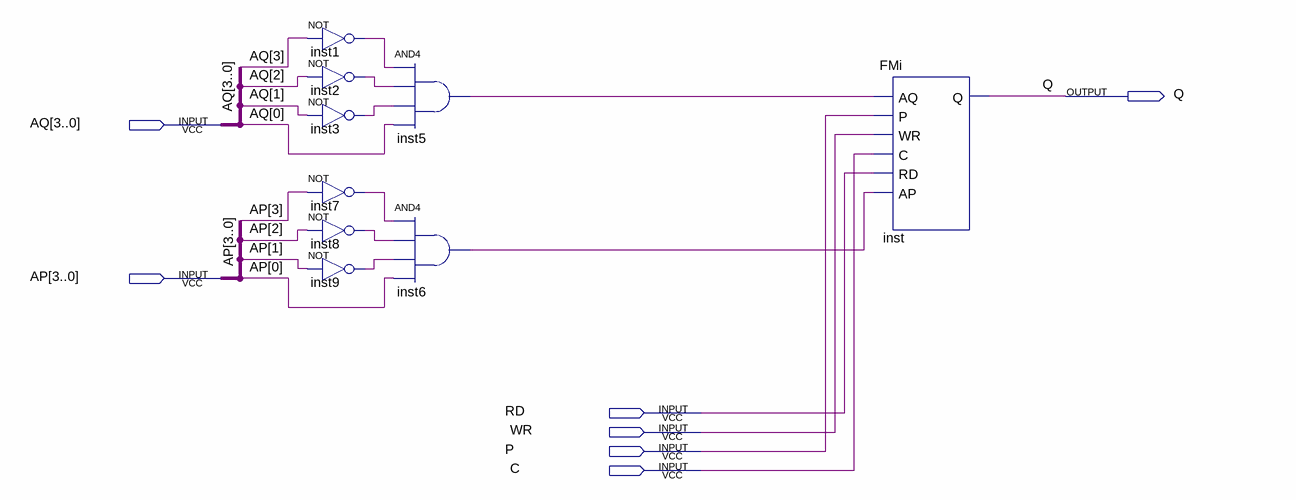
[diagram p0: schematic sheet]
// Quartus schematic FM0001.bdf as structural Verilog: 9 symbols, 7 pins
module FM0001 (
  input  [3:0] AQ,
  input  [3:0] AP,
  input  RD,
  input  WR,
  input  P,
  input  C,
  output Q
);

  wire inst1_out, inst2_out, inst3_out, inst5_out, inst6_out, inst7_out, inst8_out, inst9_out;

  not inst1 (inst1_out, AQ[3]);
  not inst2 (inst2_out, AQ[2]);
  not inst3 (inst3_out, AQ[1]);
  not inst7 (inst7_out, AP[3]);
  not inst8 (inst8_out, AP[2]);
  not inst9 (inst9_out, AP[1]);
  and inst5 (inst5_out, inst1_out, inst2_out, inst3_out, AQ[0]);
  and inst6 (inst6_out, inst7_out, inst8_out, inst9_out, AP[0]);
  FMi inst (.AQ(inst5_out), .P(P), .WR(WR), .C(C), .RD(RD), .AP(inst6_out), .Q(Q));
endmodule
